# EAGLE design NodeMCUtoMFRC522 (EAGLE 8.7.0)
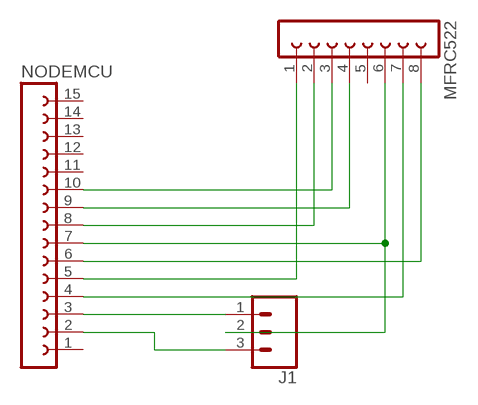
[diagram p0: schematic, sheet 1]

## Parts
J1  CONN_03POLAR  [MOLEX-1X3]
MFRC522  FE08-1  [FE08]
NODEMCU  FE15-1  [FE15]

## Nets
N$1: MFRC522.7 NODEMCU.4
N$2: MFRC522.1 NODEMCU.5
N$3: MFRC522.8 NODEMCU.6
N$4: J1.2 MFRC522.6 NODEMCU.7
N$5: MFRC522.2 NODEMCU.8
N$6: MFRC522.4 NODEMCU.9
N$7: MFRC522.3 NODEMCU.10
N$8: J1.1 NODEMCU.3
N$9: J1.3 NODEMCU.2
Unconnected: MFRC522.5 NODEMCU.1 NODEMCU.11 NODEMCU.12 NODEMCU.13 NODEMCU.14 NODEMCU.15

## Library data of the parts
J1 = SparkFun-Connectors:CONN_03: Multi connection point. Often used as Generic Header-pin footprint for 0.1 inch spaced/style header connections On any of the 0.1 inch spaced packages, you can populate with these: Break Away Headers - Straight <https://www.sparkfun.com/products/116> (PRT-00116) Break Away Male Headers - Right Angle <https://www.sparkfun.com/products/553> (PRT-00553) Female Headers <https://www.sparkfun.com/products/115> (PRT-00115) Break Away Headers - Machine Pin <https://www.sparkfun.com/products/117> (PRT-00117) Break Away Female Headers - Swiss Machine Pin <https://www.sparkfun.com/products/743> (PRT-00743) Stackable Header - 3 Pin (Female, 0.1") <https://www.sparkfun.com/products/13875> (PRT-13875) For SCREWTERMINALS and SPRING TERMINALS visit here: Screw Terimnals on SparkFun.com <https://www.sparkfun.com/search/results?term=Screw+Terminals> (5mm/3.5mm/2.54mm spacing) This device is also useful as a general connection point to wire up your design to another part of your project. Our various solder wires solder well into these plated through hole pads. Hook-Up Wire - Assortment (Stranded, 22 AWG) <https://www.sparkfun.com/products/11375> (PRT-11375) Hook-Up Wire - Assortment (Solid Core, 22 AWG) <https://www.sparkfun.com/products/11367> (PRT-11367) View the entire wire category on our website here <https://www.sparkfun.com/categories/141> Special notes: Molex polarized connector foot print use with SKU : PRT-08232 with associated crimp pins and housings.; PROD_ID: CONN-08625; SF_ID: PRT-08096
MFRC522 = con-lsta:FE08-1: FEMALE HEADER; OC_FARNELL: unknown; OC_NEWARK: unknown
NODEMCU = con-lsta:FE15-1: FEMALE HEADER; OC_FARNELL: unknown; OC_NEWARK: unknown

## Board
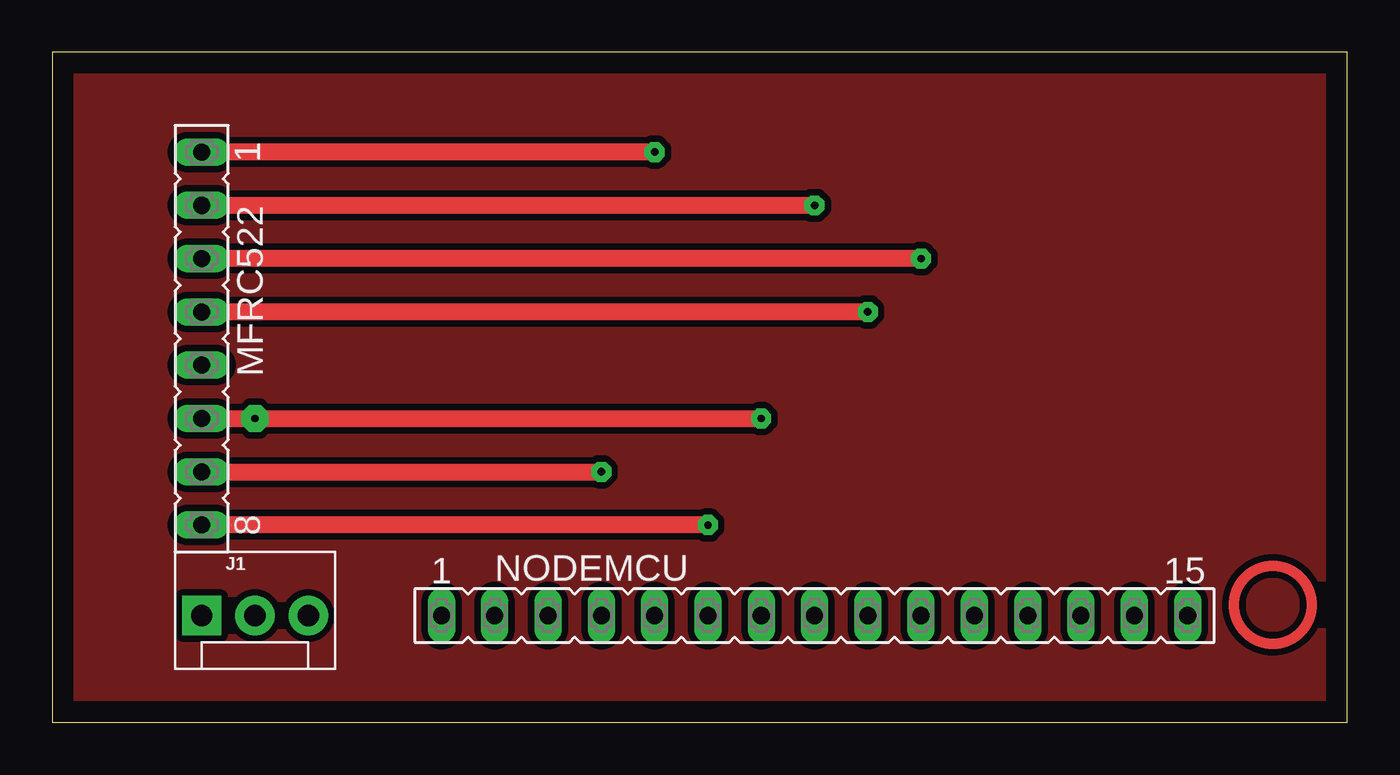
[diagram p1: board, top side]
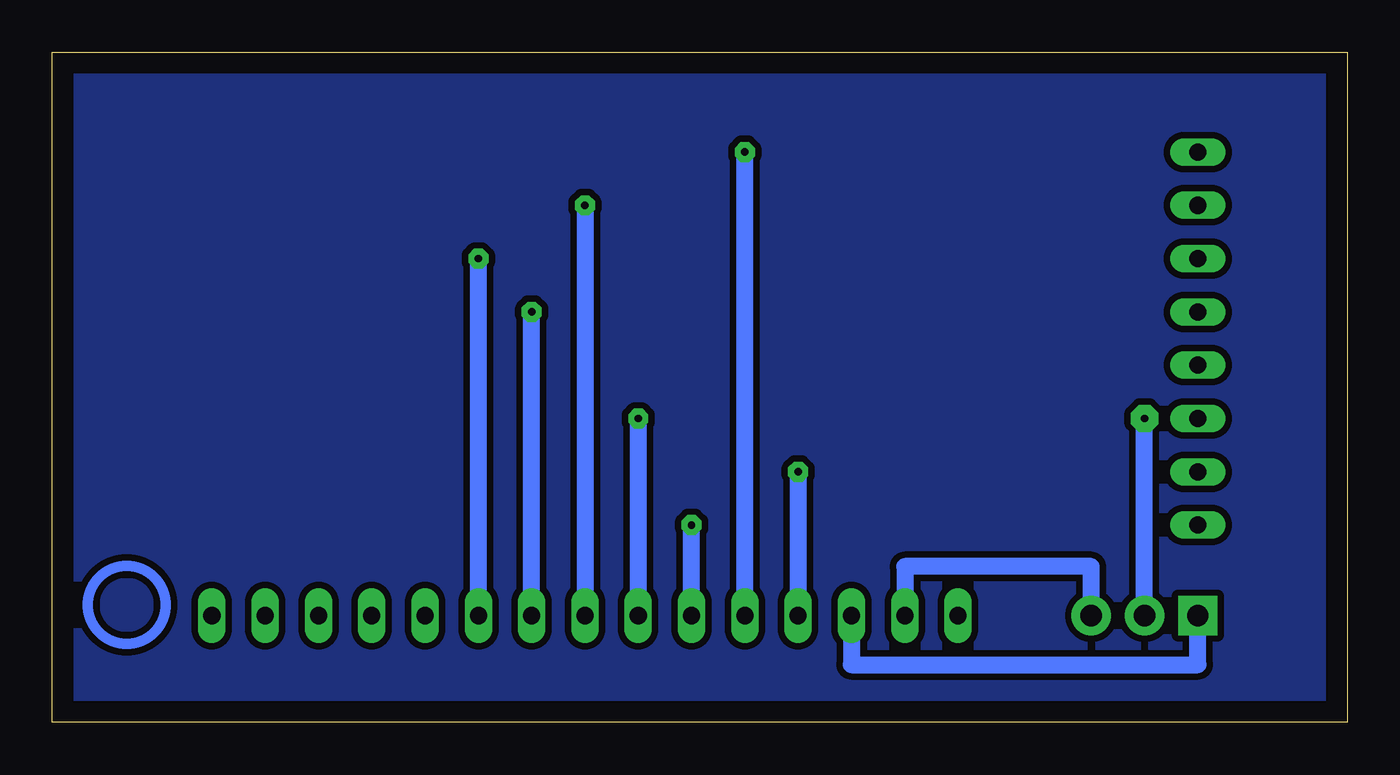
[diagram p2: board, bottom side, seen from below]

Size 61.7 x 31.93 mm. Coordinates in mm from the lower left corner, seen from the top.
Outline: 0,0 61.7,0 61.7,31.93 0,31.93 0,0
Copper layers (1*16): Top 0.035mm / dielectric 1.5mm / Bottom 0.035mm
Design rules "default *": minimum track width 6mil, minimum drill 0.35mm, track to track 12mil, track to pad 16mil, pad to pad 16mil, via to via 16mil, smd to smd 6mil, copper to edge 40mil, drill to drill 6mil, minimum pad ring 10mil, minimum via ring 8mil, stop-mask expansion 4mil, vias tented up to drill 0mil, thermal gap 10mil

### Footprints (pad centres in the part's own frame; a part is rotated, then mirrored left to right if it is on the bottom)
MOLEX-1X3 = drill 1.016 pad 1.88 square: 1 0,0 | drill 1.016 pad 1.88: 2 2.54,0; 3 5.08,0
FE08 = drill 0.813 long: 1 -8.89,0; 2 -6.35,0; 3 -3.81,0; 4 -1.27,0; 5 1.27,0; 6 3.81,0; 7 6.35,0; 8 8.89,0
FE15 = drill 0.813 long: 1 -17.78,0; 2 -15.24,0; 3 -12.7,0; 4 -10.16,0; 5 -7.62,0; 6 -5.08,0; 7 -2.54,0; 8 0,0; 9 2.54,0; 10 5.08,0; 11 7.62,0; 12 10.16,0; 13 12.7,0; 14 15.24,0; 15 17.78,0

### Placement (x,y rotation side)
J1  7.11,5.08 0 top
MFRC522  7.11,18.29 270 top
NODEMCU  36.32,5.08 0 top

### Tracks (layer width: path | path; a pad name or v marks a point on that pad's centre or on a via)
N$1  (via drill 0.35 pad 0.95)
  Top 0.813: MFRC522.7 v26.16,11.94
  Bottom 0.813: v26.16,11.94 NODEMCU.4
N$2  (via drill 0.35 pad 0.95)
  Top 0.813: v28.7,27.18 MFRC522.1
  Bottom 0.813: NODEMCU.5 v28.7,27.18
N$3  (via drill 0.35 pad 0.95)
  Top 0.813: v31.24,9.4 MFRC522.8
  Bottom 0.813: NODEMCU.6 v31.24,9.4
N$4  (via drill 0.35 pad 0.95, 0.35 pad 1.3)
  Top 0.813: MFRC522.6 v9.65,14.48 v33.78,14.48
  Bottom 0.813: v33.78,14.48 NODEMCU.7 | J1.2 v9.65,14.48
N$5  (via drill 0.35 pad 0.95)
  Top 0.813: MFRC522.2 v36.32,24.64
  Bottom 0.813: v36.32,24.64 NODEMCU.8
N$6  (via drill 0.35 pad 0.95)
  Top 0.813: v38.86,19.56 MFRC522.4
  Bottom 0.813: NODEMCU.9 v38.86,19.56
N$7  (via drill 0.35 pad 0.95)
  Top 0.813: v41.4,22.1 MFRC522.3
  Bottom 0.813: NODEMCU.10 v41.4,22.1
N$8
  Bottom 0.813: NODEMCU.3 23.62,2.74 7.11,2.74 J1.1
N$9
  Bottom 0.813: J1.3 12.19,7.42 21.08,7.42 NODEMCU.2
N$10
  pour Top: 0,32 61.47,32 61.72,31.75 61.72,0 0,0
N$11
  pour Bottom: 0,31.75 61.72,31.75 61.98,31.5 61.98,0.25 0,0.25
(copper drawn outside any net)
  shapes: Bottom circle x1, Top circle x1